# EAGLE design HM10-Temp (EAGLE 7.4.0)
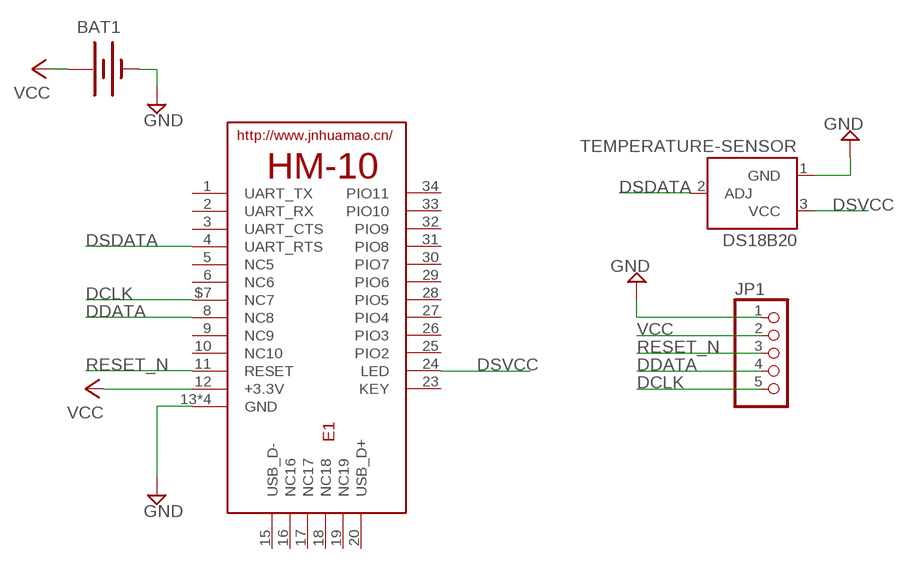
[diagram p0: schematic, sheet 1]

## Parts
BAT1  BATTERY20PTH  [BATTCOM_20MM_PTH]
DS18B20  TEMPERATURE-SENSOR  [TO-92]
E1  HM-10-BOARD  [26.9X13X2.2_BOARD]
JP1  PINHD-1X5  [1X05]

## Nets
DCLK: E1.$7(NC7) JP1.5
DDATA: E1.8(NC8) JP1.4
DSDATA: DS18B20.2(ADJ) E1.4(UART_RTS)
DSVCC: DS18B20.3(VCC) E1.24(LED)
GND: BAT1.2(-) DS18B20.1(GND) E1.13(GND) E1.14(GND) E1.21(GND) E1.22(GND) JP1.1
RESET_N: E1.11(RESET) JP1.3
VCC: BAT1.1(+) E1.12(+3.3V) JP1.2
Unconnected: E1.1(UART_TX) E1.2(UART_RX) E1.3(UART_CTS) E1.5(NC5) E1.6(NC6) E1.9(NC9) E1.10(NC10) E1.15(USB_D-) E1.16(NC16) E1.17(NC17) E1.18(NC18) E1.19(NC19) E1.20(USB_D+) E1.23(KEY) E1.25(PIO2) E1.26(PIO3) E1.27(PIO4) E1.28(PIO5) E1.29(PIO6) E1.30(PIO7) E1.31(PIO8) E1.32(PIO9) E1.33(PIO10) E1.34(PIO11)

## Library data of the parts
BAT1 = SparkFun-Electromechanical:BATTERY: Battery Holders Various common sizes : AA, AAA, 18650 (PRT-12895), 20mm coin cell and 12mm coin cell. 20MM_4LEGS, BATT-10373
DS18B20 = SparkFun-Sensors:TEMPERATURE-SENSOR: TO-92 temp sensor
E1 = HM-10:HM-10: HM Bluetooth module use TI CC2540 or CC2541, Master and slave roles in one, transmission version and remote control version and PIO state acquisition functions in one, Support the AT command modify module parameters, Convenient and flexible.
JP1 = pinhead:PINHD-1X5: PIN HEADER

## Board
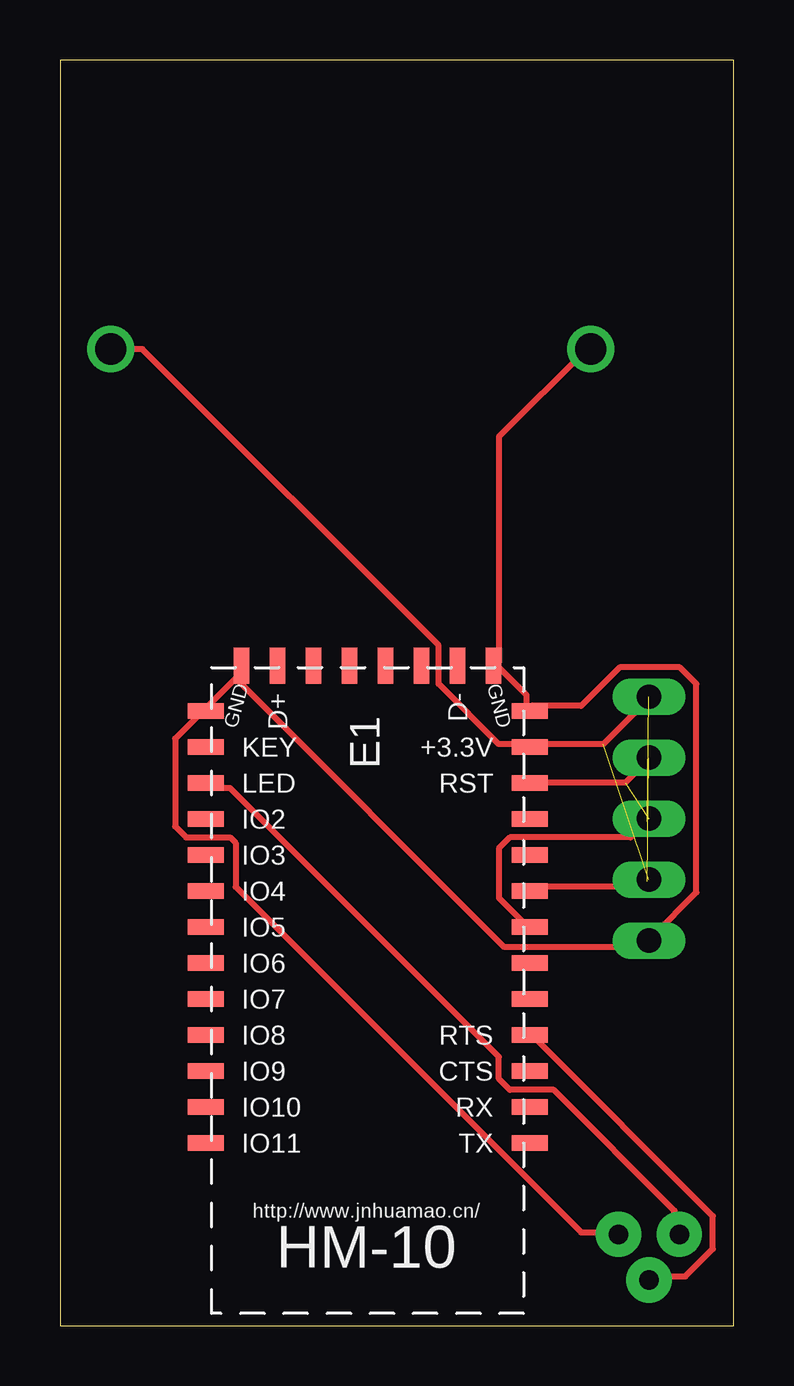
[diagram p1: board, top side]
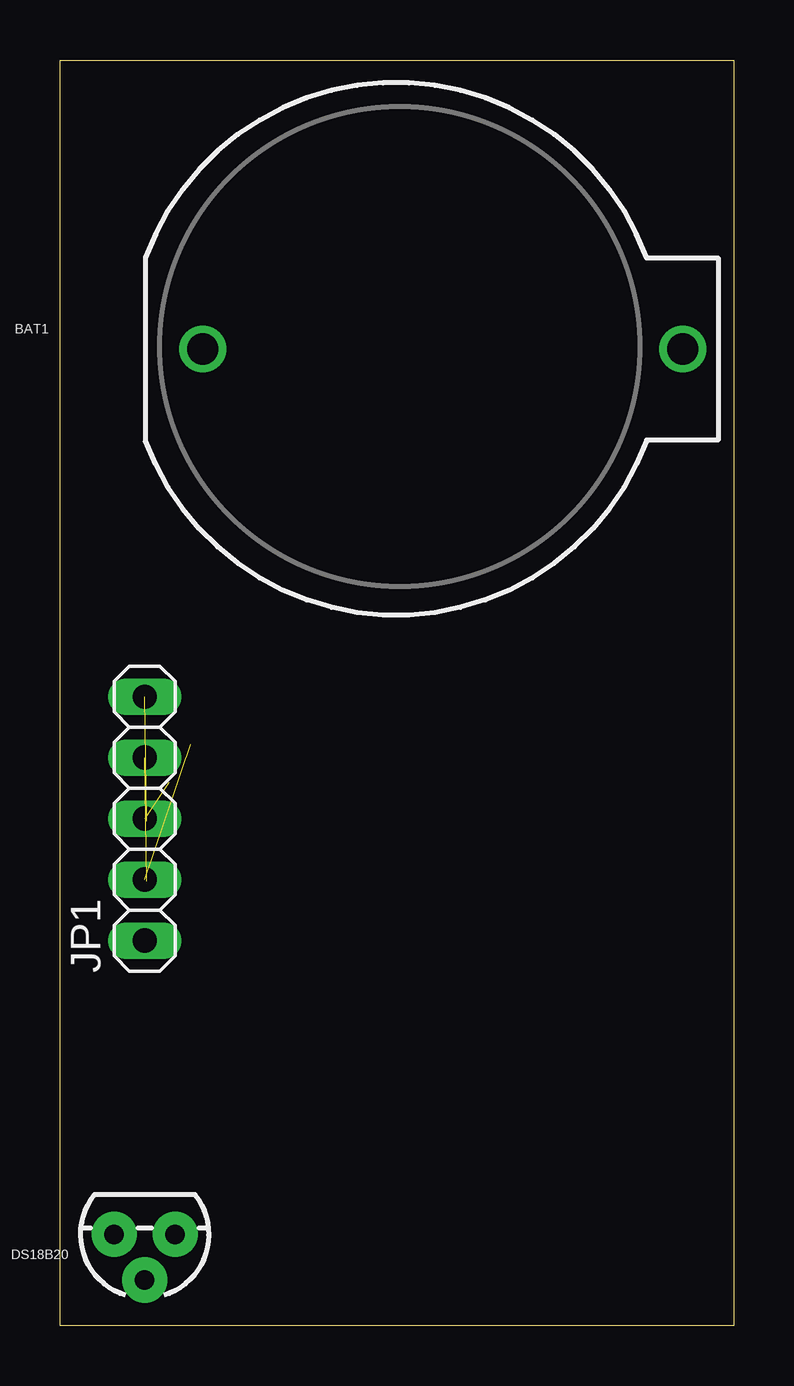
[diagram p2: board, bottom side, seen from below]

Size 28.07 x 52.74 mm. Coordinates in mm from the lower left corner, seen from the top.
Outline: 0,0 28.07,0 28.07,52.74 0,52.74 0,0
Copper layers (1*16): Top 0.035mm / dielectric 1.5mm / Bottom 0.035mm
Design rules "default *": minimum track width 10mil, minimum drill 24mil, track to track 8mil, track to pad 8mil, pad to pad 8mil, via to via 8mil, smd to smd 8mil, copper to edge 15mil, drill to drill 8mil, minimum pad ring 10mil, minimum via ring 8mil, stop-mask expansion 4mil, vias tented up to drill 0mil, thermal gap 10mil

### Footprints (pad centres in the part's own frame; a part is rotated, then mirrored left to right if it is on the bottom)
BATTCOM_20MM_PTH = drill 1.3: 1 11.85,0; 2 -8.15,0
TO-92 = drill 0.813 pad 1.88: 1 -1.27,0; 2 0,1.905; 3 1.27,0
26.9X13X2.2_BOARD = smd 1.5 x 0.635: 1 -7.5,0; 2 -7.5,-1.5; 3 -7.5,-3; 4 -7.5,-4.5; 5 -7.5,-6; 6 -7.5,-7.5; 8 -7.5,-10.5; 9 -7.5,-12; 10 -7.5,-13.5; 11 -7.5,-15; 12 -7.5,-16.5; 13 -7.5,-18; 22 6,-18; 23 6,-16.5; 24 6,-15; 25 6,-13.5; 26 6,-12; 27 6,-10.5; 28 6,-9; 29 6,-7.5; 30 6,-6; 31 6,-4.5; 32 6,-3; 33 6,-1.5; 34 6,0; $7 -7.5,-9 | smd 0.635 x 1.5: 14 -6,-19.875; 15 -4.5,-19.875; 16 -3,-19.875; 17 -1.5,-19.875; 18 0,-19.875; 19 1.5,-19.875; 20 3,-19.875; 21 4.5,-19.875
1X05 = drill 1.016 long: 1 -5.08,0; 2 -2.54,0; 3 0,0; 4 2.54,0; 5 5.08,0

### Placement (x,y rotation side)
BAT1  13.97,40.7 0 bottom
DS18B20  24.54,3.81 180 bottom
E1  12.06,7.62 180 top
JP1  24.54,21.13 90 bottom

### Tracks (layer width: path | path; a pad name or v marks a point on that pad's centre or on a via)
DCLK  (1 unrouted)
  Top 0.254: 24.46,21.03 23.77,20.34 18.75,20.34 18.29,19.89 18.29,17.83 19.43,16.69 E1.$7
DDATA  (1 unrouted)
  Top 0.254: 24.46,18.52 24.23,18.29 19.66,18.29 E1.8
DSDATA
  Top 0.254: E1.4 19.66,12.12 27.2,4.57 27.2,3.2 26.06,2.06 24.69,2.06 DS18B20.2
DSVCC
  Top 0.254: E1.24 6.17,22.4 7.09,22.4 18.29,11.2 18.29,10.29 18.75,9.83 20.57,9.83 25.6,4.8 25.6,3.89 DS18B20.3
GND
  Top 0.254: BAT1.2 21.95,40.69 18.29,37.03 18.29,27.66 E1.14 18.29,27.43 19.43,26.29 19.43,25.83 E1.13 19.66,25.83 21.72,25.83 23.32,27.43 25.83,27.43 26.52,26.75 26.52,18.06 24.69,16.23 JP1.1 24.46,16 24.23,15.77 18.52,15.77 7.32,26.98 | 7.32,26.98 7.77,27.43 E1.21 7.32,26.98 | 7.32,26.98 6.17,25.83 E1.22 5.94,25.6 4.8,24.46 4.8,20.8 5.26,20.34 7.09,20.34 7.32,20.12 7.32,18.29 21.72,3.89 23.09,3.89 DS18B20.1
RESET_N  (1 unrouted)
  Top 0.254: 24.46,23.55 23.55,22.63 19.66,22.63 E1.11
VCC  (1 unrouted)
  Top 0.254: 24.46,26.06 22.63,24.23 19.66,24.23 E1.12 19.43,24.23 18.29,24.23 15.77,26.75 15.77,28.35 3.43,40.69 2.29,40.69 BAT1.1